# Altium schematic sheet LO_tap.SchDoc
size A
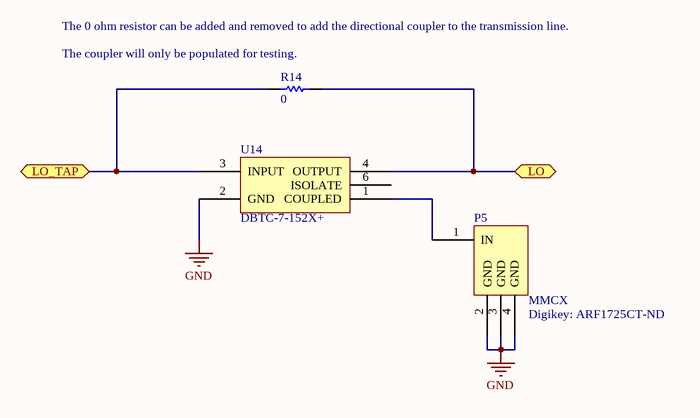
[diagram p0: LO_tap.SchDoc]

## Parts
P5  MMCX
R14  value 0  [0402]  (hidden comment: Res Semi)
U14  DBTC-7-152X+

## Ports
LO, LO_TAP

## Nets
GND: P5.2(GND) P5.3(GND) P5.4(GND) U14.2(GND)
LO: R14.1 U14.4(OUTPUT) ; port LO
LO_TAP: R14.2 U14.3(INPUT) ; port LO_TAP
NetP5_1: P5.1(IN) U14.1(COUPLED)

Not connected (* = marked no-connect by the designer): U14 6(ISOLATE)

## Notes on the sheet
- The 0 ohm resistor can be added and removed to add the directional coupler to the transmission line.
- (near R14) The coupler will only be populated for testing.
- (near P5) Digikey: ARF1725CT-ND

## Library data of the parts
R14 = Res Semi: Semiconductor Resistor; Published: 8-Jun-2000; LatestRevisionDate: 17-Jul-2002; LatestRevisionNote: Re-released for DXP Platform.; PackageReference: AXIAL-0.5; Publisher: Altium Limited; PackageDescription: Axial Device, Thru-Hole; 2 Leads; 0.5 in Pin Spacing